# EAGLE design KeyboardMatrixRGB (EAGLE 9.6.2)
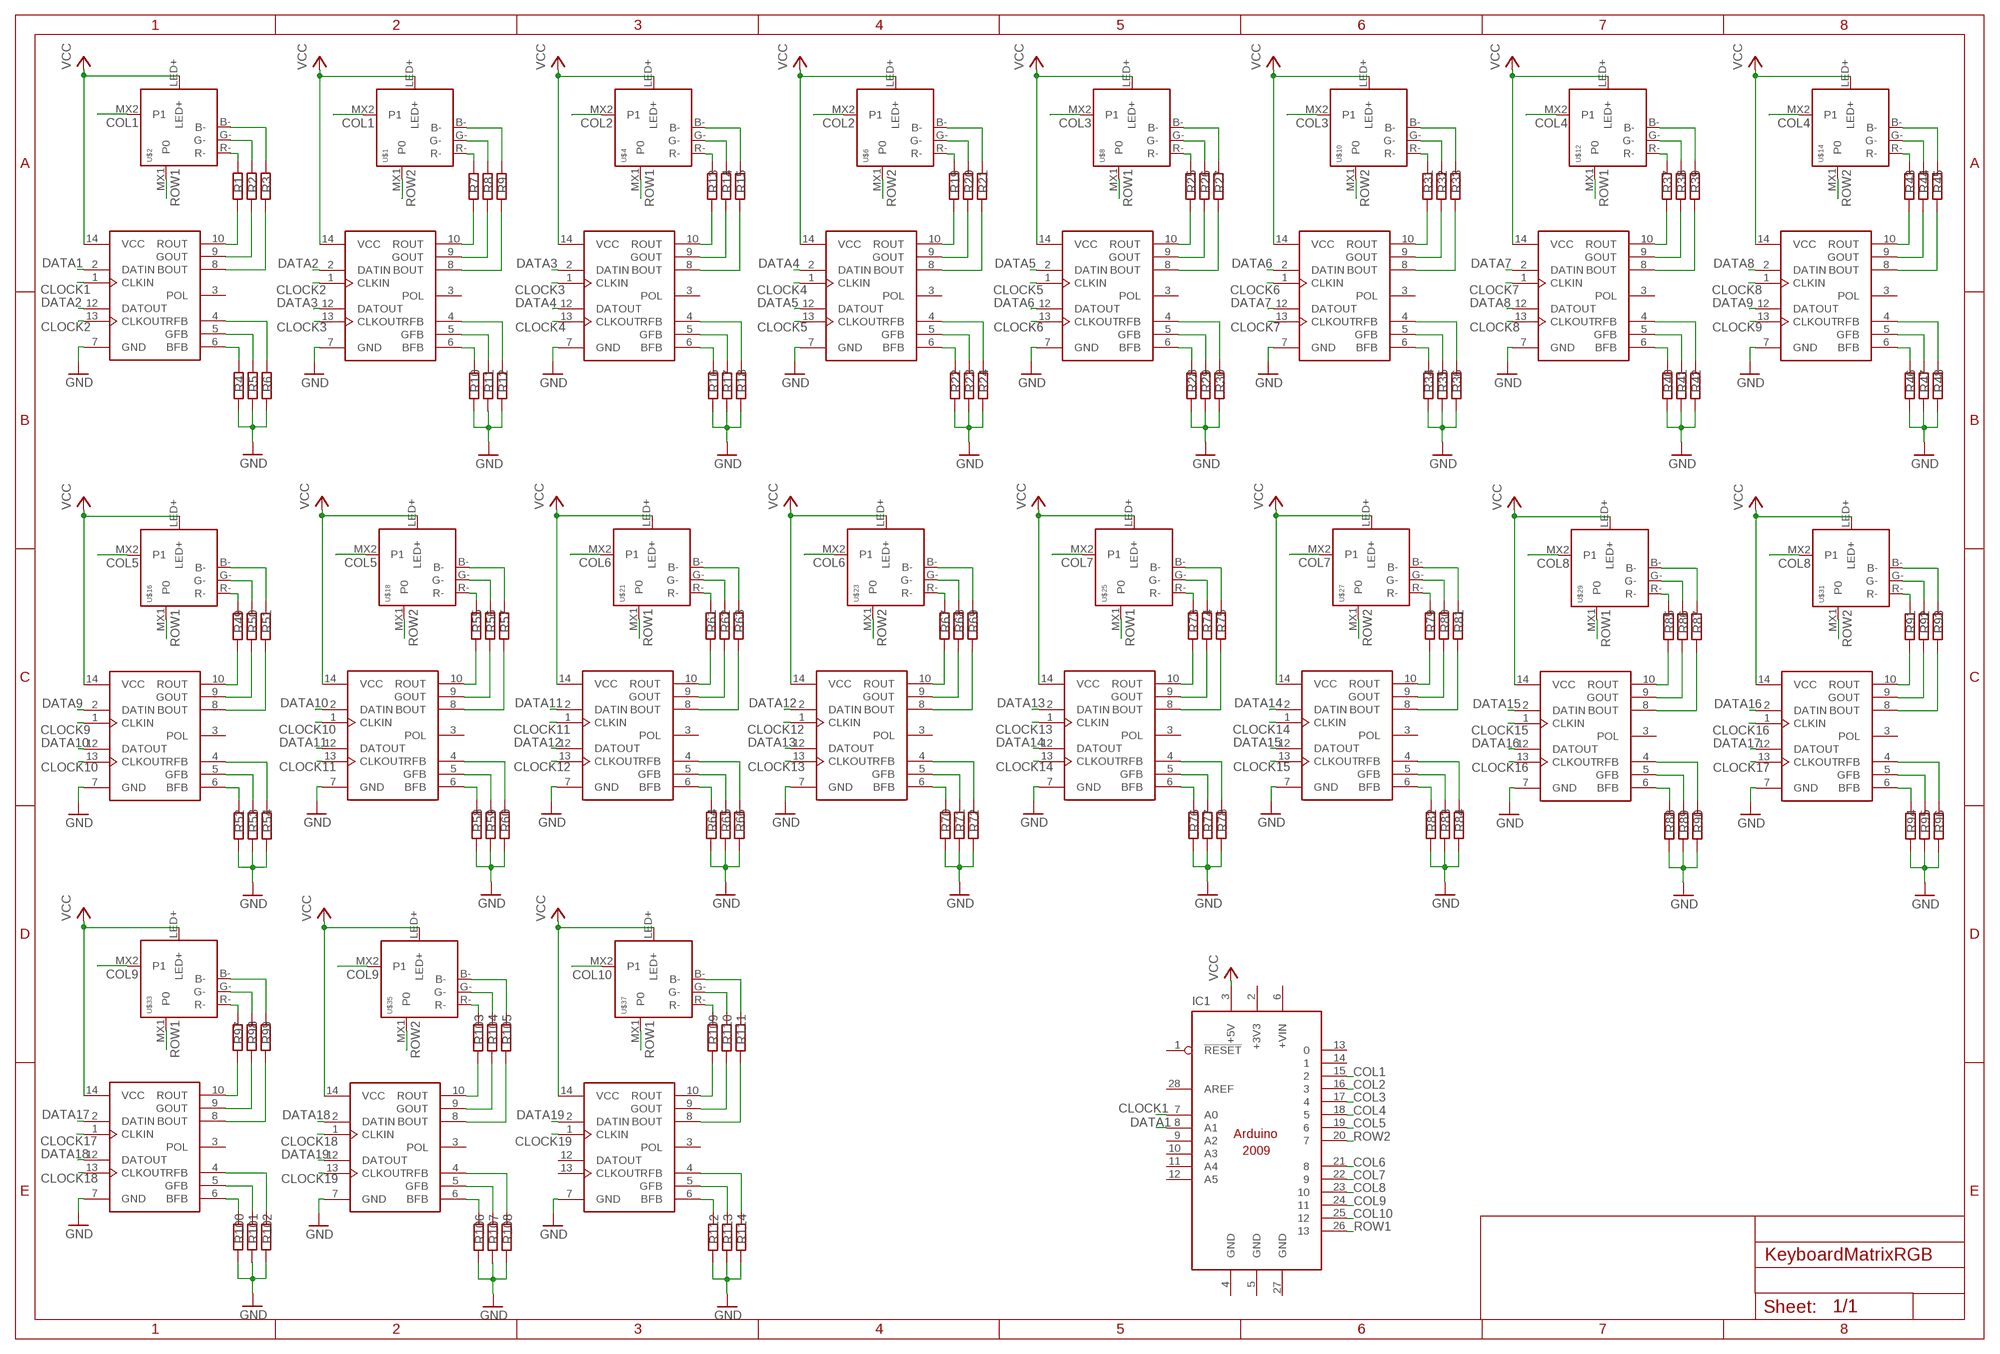
[diagram p0: schematic, sheet 1]

## Parts
IC1  ARDUINO2009_10  [ARDUINO2009]
R1  R-EU_0204/5  [0204/5]
R2  R-EU_0204/5  [0204/5]
R3  R-EU_0204/5  [0204/5]
R4  R-EU_0204/5  [0204/5]
R5  R-EU_0204/5  [0204/5]
R6  R-EU_0204/5  [0204/5]
R7  R-EU_0204/5  [0204/5]
R8  R-EU_0204/5  [0204/5]
R9  R-EU_0204/5  [0204/5]
R10  R-EU_0204/5  [0204/5]
R11  R-EU_0204/5  [0204/5]
R12  R-EU_0204/5  [0204/5]
R13  R-EU_0204/5  [0204/5]
R14  R-EU_0204/5  [0204/5]
R15  R-EU_0204/5  [0204/5]
R16  R-EU_0204/5  [0204/5]
R17  R-EU_0204/5  [0204/5]
R18  R-EU_0204/5  [0204/5]
R19  R-EU_0204/5  [0204/5]
R20  R-EU_0204/5  [0204/5]
R21  R-EU_0204/5  [0204/5]
R22  R-EU_0204/5  [0204/5]
R23  R-EU_0204/5  [0204/5]
R24  R-EU_0204/5  [0204/5]
R25  R-EU_0204/5  [0204/5]
R26  R-EU_0204/5  [0204/5]
R27  R-EU_0204/5  [0204/5]
R28  R-EU_0204/5  [0204/5]
R29  R-EU_0204/5  [0204/5]
R30  R-EU_0204/5  [0204/5]
R31  R-EU_0204/5  [0204/5]
R32  R-EU_0204/5  [0204/5]
R33  R-EU_0204/5  [0204/5]
R34  R-EU_0204/5  [0204/5]
R35  R-EU_0204/5  [0204/5]
R36  R-EU_0204/5  [0204/5]
R37  R-EU_0204/5  [0204/5]
R38  R-EU_0204/5  [0204/5]
R39  R-EU_0204/5  [0204/5]
R40  R-EU_0204/5  [0204/5]
R41  R-EU_0204/5  [0204/5]
R42  R-EU_0204/5  [0204/5]
R43  R-EU_0204/5  [0204/5]
R44  R-EU_0204/5  [0204/5]
R45  R-EU_0204/5  [0204/5]
R46  R-EU_0204/5  [0204/5]
R47  R-EU_0204/5  [0204/5]
R48  R-EU_0204/5  [0204/5]
R49  R-EU_0204/5  [0204/5]
R50  R-EU_0204/5  [0204/5]
R51  R-EU_0204/5  [0204/5]
R52  R-EU_0204/5  [0204/5]
R53  R-EU_0204/5  [0204/5]
R54  R-EU_0204/5  [0204/5]
R55  R-EU_0204/5  [0204/5]
R56  R-EU_0204/5  [0204/5]
R57  R-EU_0204/5  [0204/5]
R58  R-EU_0204/5  [0204/5]
R59  R-EU_0204/5  [0204/5]
R60  R-EU_0204/5  [0204/5]
R61  R-EU_0204/5  [0204/5]
R62  R-EU_0204/5  [0204/5]
R63  R-EU_0204/5  [0204/5]
R64  R-EU_0204/5  [0204/5]
R65  R-EU_0204/5  [0204/5]
R66  R-EU_0204/5  [0204/5]
R67  R-EU_0204/5  [0204/5]
R68  R-EU_0204/5  [0204/5]
R69  R-EU_0204/5  [0204/5]
R70  R-EU_0204/5  [0204/5]
R71  R-EU_0204/5  [0204/5]
R72  R-EU_0204/5  [0204/5]
R73  R-EU_0204/5  [0204/5]
R74  R-EU_0204/5  [0204/5]
R75  R-EU_0204/5  [0204/5]
R76  R-EU_0204/5  [0204/5]
R77  R-EU_0204/5  [0204/5]
R78  R-EU_0204/5  [0204/5]
R79  R-EU_0204/5  [0204/5]
R80  R-EU_0204/5  [0204/5]
R81  R-EU_0204/5  [0204/5]
R82  R-EU_0204/5  [0204/5]
R83  R-EU_0204/5  [0204/5]
R84  R-EU_0204/5  [0204/5]
R85  R-EU_0204/5  [0204/5]
R86  R-EU_0204/5  [0204/5]
R87  R-EU_0204/5  [0204/5]
R88  R-EU_0204/5  [0204/5]
R89  R-EU_0204/5  [0204/5]
R90  R-EU_0204/5  [0204/5]
R91  R-EU_0204/5  [0204/5]
R92  R-EU_0204/5  [0204/5]
R93  R-EU_0204/5  [0204/5]
R94  R-EU_0204/5  [0204/5]
R95  R-EU_0204/5  [0204/5]
R96  R-EU_0204/5  [0204/5]
R97  R-EU_0204/5  [0204/5]
R98  R-EU_0204/5  [0204/5]
R99  R-EU_0204/5  [0204/5]
R100  R-EU_0204/5  [0204/5]
R101  R-EU_0204/5  [0204/5]
R102  R-EU_0204/5  [0204/5]
R103  R-EU_0204/5  [0204/5]
R104  R-EU_0204/5  [0204/5]
R105  R-EU_0204/5  [0204/5]
R106  R-EU_0204/5  [0204/5]
R107  R-EU_0204/5  [0204/5]
R108  R-EU_0204/5  [0204/5]
R109  R-EU_0204/5  [0204/5]
R110  R-EU_0204/5  [0204/5]
R111  R-EU_0204/5  [0204/5]
R112  R-EU_0204/5  [0204/5]
R113  R-EU_0204/5  [0204/5]
R114  R-EU_0204/5  [0204/5]
U$1  KEYSWITCH-RGBLED-MX-1U-RGB  [MX-1U-RGB]
U$2  KEYSWITCH-RGBLED-MX-1U-RGB  [MX-1U-RGB]
U$3  WS2801  [SOP14]
U$4  KEYSWITCH-RGBLED-MX-1U-RGB  [MX-1U-RGB]
U$5  WS2801  [SOP14]
U$6  KEYSWITCH-RGBLED-MX-1U-RGB  [MX-1U-RGB]
U$7  WS2801  [SOP14]
U$8  KEYSWITCH-RGBLED-MX-1U-RGB  [MX-1U-RGB]
U$9  WS2801  [SOP14]
U$10  KEYSWITCH-RGBLED-MX-1U-RGB  [MX-1U-RGB]
U$11  WS2801  [SOP14]
U$12  KEYSWITCH-RGBLED-MX-1U-RGB  [MX-1U-RGB]
U$13  WS2801  [SOP14]
U$14  KEYSWITCH-RGBLED-MX-1U-RGB  [MX-1U-RGB]
U$15  WS2801  [SOP14]
U$16  KEYSWITCH-RGBLED-MX-1U-RGB  [MX-1U-RGB]
U$17  WS2801  [SOP14]
U$18  KEYSWITCH-RGBLED-MX-1U-RGB  [MX-1U-RGB]
U$19  WS2801  [SOP14]
U$20  WS2801  [SOP14]
U$21  KEYSWITCH-RGBLED-MX-1U-RGB  [MX-1U-RGB]
U$22  WS2801  [SOP14]
U$23  KEYSWITCH-RGBLED-MX-1U-RGB  [MX-1U-RGB]
U$24  WS2801  [SOP14]
U$25  KEYSWITCH-RGBLED-MX-1U-RGB  [MX-1U-RGB]
U$26  WS2801  [SOP14]
U$27  KEYSWITCH-RGBLED-MX-1U-RGB  [MX-1U-RGB]
U$28  WS2801  [SOP14]
U$29  KEYSWITCH-RGBLED-MX-1U-RGB  [MX-1U-RGB]
U$30  WS2801  [SOP14]
U$31  KEYSWITCH-RGBLED-MX-1U-RGB  [MX-1U-RGB]
U$32  WS2801  [SOP14]
U$33  KEYSWITCH-RGBLED-MX-1U-RGB  [MX-1U-RGB]
U$34  WS2801  [SOP14]
U$35  KEYSWITCH-RGBLED-MX-1U-RGB  [MX-1U-RGB]
U$36  WS2801  [SOP14]
U$37  KEYSWITCH-RGBLED-MX-1U-RGB  [MX-1U-RGB]
U$38  WS2801  [SOP14]

## Nets
CLOCK1: IC1.7(A0) U$20.1(CLKIN)
CLOCK2: U$3.1(CLKIN) U$20.13(CLKOUT)
CLOCK3: U$3.13(CLKOUT) U$5.1(CLKIN)
CLOCK4: U$5.13(CLKOUT) U$7.1(CLKIN)
CLOCK5: U$7.13(CLKOUT) U$9.1(CLKIN)
CLOCK6: U$9.13(CLKOUT) U$11.1(CLKIN)
CLOCK7: U$11.13(CLKOUT) U$13.1(CLKIN)
CLOCK8: U$13.13(CLKOUT) U$15.1(CLKIN)
CLOCK9: U$15.13(CLKOUT) U$17.1(CLKIN)
CLOCK10: U$17.13(CLKOUT) U$19.1(CLKIN)
CLOCK11: U$19.13(CLKOUT) U$22.1(CLKIN)
CLOCK12: U$22.13(CLKOUT) U$24.1(CLKIN)
CLOCK13: U$24.13(CLKOUT) U$26.1(CLKIN)
CLOCK14: U$26.13(CLKOUT) U$28.1(CLKIN)
CLOCK15: U$28.13(CLKOUT) U$30.1(CLKIN)
CLOCK16: U$30.13(CLKOUT) U$32.1(CLKIN)
CLOCK17: U$32.13(CLKOUT) U$34.1(CLKIN)
CLOCK18: U$34.13(CLKOUT) U$36.1(CLKIN)
CLOCK19: U$36.13(CLKOUT) U$38.1(CLKIN)
COL1: IC1.15 U$1.MX2(P1) U$2.MX2(P1)
COL2: IC1.16 U$4.MX2(P1) U$6.MX2(P1)
COL3: IC1.17 U$8.MX2(P1) U$10.MX2(P1)
COL4: IC1.18 U$12.MX2(P1) U$14.MX2(P1)
COL5: IC1.19 U$16.MX2(P1) U$18.MX2(P1)
COL6: IC1.21 U$21.MX2(P1) U$23.MX2(P1)
COL7: IC1.22 U$25.MX2(P1) U$27.MX2(P1)
COL8: IC1.23 U$29.MX2(P1) U$31.MX2(P1)
COL9: IC1.24 U$33.MX2(P1) U$35.MX2(P1)
COL10: IC1.25 U$37.MX2(P1)
DATA1: IC1.8(A1) U$20.2(DATIN)
DATA2: U$3.2(DATIN) U$20.12(DATOUT)
DATA3: U$3.12(DATOUT) U$5.2(DATIN)
DATA4: U$5.12(DATOUT) U$7.2(DATIN)
DATA5: U$7.12(DATOUT) U$9.2(DATIN)
DATA6: U$9.12(DATOUT) U$11.2(DATIN)
DATA7: U$11.12(DATOUT) U$13.2(DATIN)
DATA8: U$13.12(DATOUT) U$15.2(DATIN)
DATA9: U$15.12(DATOUT) U$17.2(DATIN)
DATA10: U$17.12(DATOUT) U$19.2(DATIN)
DATA11: U$19.12(DATOUT) U$22.2(DATIN)
DATA12: U$22.12(DATOUT) U$24.2(DATIN)
DATA13: U$24.12(DATOUT) U$26.2(DATIN)
DATA14: U$26.12(DATOUT) U$28.2(DATIN)
DATA15: U$28.12(DATOUT) U$30.2(DATIN)
DATA16: U$30.12(DATOUT) U$32.2(DATIN)
DATA17: U$32.12(DATOUT) U$34.2(DATIN)
DATA18: U$34.12(DATOUT) U$36.2(DATIN)
DATA19: U$36.12(DATOUT) U$38.2(DATIN)
GND: R4.1 R5.1 R6.1 R10.1 R11.1 R12.1 R16.1 R17.1 R18.1 R22.1 R23.1 R24.1 R28.1 R29.1 R30.1 R34.1 R35.1 R36.1 R40.1 R41.1 R42.1 R46.1 R47.1 R48.1 R52.1 R53.1 R54.1 R58.1 R59.1 R60.1 R64.1 R65.1 R66.1 R70.1 R71.1 R72.1 R76.1 R77.1 R78.1 R82.1 R83.1 R84.1 R88.1 R89.1 R90.1 R94.1 R95.1 R96.1 R100.1 R101.1 R102.1 R106.1 R107.1 R108.1 R112.1 R113.1 R114.1 U$3.7(GND) U$5.7(GND) U$7.7(GND) U$9.7(GND) U$11.7(GND) U$13.7(GND) U$15.7(GND) U$17.7(GND) U$19.7(GND) U$20.7(GND) U$22.7(GND) U$24.7(GND) U$26.7(GND) U$28.7(GND) U$30.7(GND) U$32.7(GND) U$34.7(GND) U$36.7(GND) U$38.7(GND)
N$1: R1.2 U$2.R-
N$2: R2.2 U$2.G-
N$3: R3.2 U$2.B-
N$4: R1.1 U$20.10(ROUT)
N$5: R2.1 U$20.9(GOUT)
N$6: R3.1 U$20.8(BOUT)
N$7: R4.2 U$20.6(BFB)
N$8: R5.2 U$20.5(GFB)
N$9: R6.2 U$20.4(RFB)
N$10: R49.2 U$16.R-
N$11: R7.2 U$1.R-
N$12: R8.2 U$1.G-
N$13: R9.2 U$1.B-
N$14: R7.1 U$3.10(ROUT)
N$15: R8.1 U$3.9(GOUT)
N$16: R9.1 U$3.8(BOUT)
N$17: R10.2 U$3.6(BFB)
N$18: R11.2 U$3.5(GFB)
N$19: R12.2 U$3.4(RFB)
N$20: R13.2 U$4.R-
N$21: R14.2 U$4.G-
N$22: R15.2 U$4.B-
N$23: R13.1 U$5.10(ROUT)
N$24: R14.1 U$5.9(GOUT)
N$25: R15.1 U$5.8(BOUT)
N$26: R16.2 U$5.6(BFB)
N$27: R17.2 U$5.5(GFB)
N$28: R18.2 U$5.4(RFB)
N$29: R19.2 U$6.R-
N$30: R20.2 U$6.G-
N$31: R21.2 U$6.B-
N$32: R19.1 U$7.10(ROUT)
N$33: R20.1 U$7.9(GOUT)
N$34: R21.1 U$7.8(BOUT)
N$35: R22.2 U$7.6(BFB)
N$36: R23.2 U$7.5(GFB)
N$37: R24.2 U$7.4(RFB)
N$38: R25.2 U$8.R-
N$39: R26.2 U$8.G-
N$40: R27.2 U$8.B-
N$41: R25.1 U$9.10(ROUT)
N$42: R26.1 U$9.9(GOUT)
N$43: R27.1 U$9.8(BOUT)
N$44: R28.2 U$9.6(BFB)
N$45: R29.2 U$9.5(GFB)
N$46: R30.2 U$9.4(RFB)
N$47: R31.2 U$10.R-
N$48: R32.2 U$10.G-
N$49: R33.2 U$10.B-
N$50: R31.1 U$11.10(ROUT)
N$51: R32.1 U$11.9(GOUT)
N$52: R33.1 U$11.8(BOUT)
N$53: R34.2 U$11.6(BFB)
N$54: R35.2 U$11.5(GFB)
N$55: R36.2 U$11.4(RFB)
N$56: R37.2 U$12.R-
N$57: R38.2 U$12.G-
N$58: R39.2 U$12.B-
N$59: R37.1 U$13.10(ROUT)
N$60: R38.1 U$13.9(GOUT)
N$61: R39.1 U$13.8(BOUT)
N$62: R40.2 U$13.6(BFB)
N$63: R41.2 U$13.5(GFB)
N$64: R42.2 U$13.4(RFB)
N$65: R43.2 U$14.R-
N$66: R44.2 U$14.G-
N$67: R45.2 U$14.B-
N$68: R43.1 U$15.10(ROUT)
N$69: R44.1 U$15.9(GOUT)
N$70: R45.1 U$15.8(BOUT)
N$71: R46.2 U$15.6(BFB)
N$72: R47.2 U$15.5(GFB)
N$73: R48.2 U$15.4(RFB)
N$74: R50.2 U$16.G-
N$75: R51.2 U$16.B-
N$76: R49.1 U$17.10(ROUT)
N$77: R50.1 U$17.9(GOUT)
N$78: R51.1 U$17.8(BOUT)
N$79: R52.2 U$17.6(BFB)
N$80: R53.2 U$17.5(GFB)
N$81: R54.2 U$17.4(RFB)
N$82: R97.2 U$33.R-
N$83: R55.2 U$18.R-
N$84: R56.2 U$18.G-
N$85: R57.2 U$18.B-
N$86: R55.1 U$19.10(ROUT)
N$87: R56.1 U$19.9(GOUT)
N$88: R57.1 U$19.8(BOUT)
N$89: R58.2 U$19.6(BFB)
N$90: R59.2 U$19.5(GFB)
N$91: R60.2 U$19.4(RFB)
N$92: R61.2 U$21.R-
N$93: R62.2 U$21.G-
N$94: R63.2 U$21.B-
N$95: R61.1 U$22.10(ROUT)
N$96: R62.1 U$22.9(GOUT)
N$97: R63.1 U$22.8(BOUT)
N$98: R64.2 U$22.6(BFB)
N$99: R65.2 U$22.5(GFB)
N$100: R66.2 U$22.4(RFB)
N$101: R67.2 U$23.R-
N$102: R68.2 U$23.G-
N$103: R69.2 U$23.B-
N$104: R67.1 U$24.10(ROUT)
N$105: R68.1 U$24.9(GOUT)
N$106: R69.1 U$24.8(BOUT)
N$107: R70.2 U$24.6(BFB)
N$108: R71.2 U$24.5(GFB)
N$109: R72.2 U$24.4(RFB)
N$110: R73.2 U$25.R-
N$111: R74.2 U$25.G-
N$112: R75.2 U$25.B-
N$113: R73.1 U$26.10(ROUT)
N$114: R74.1 U$26.9(GOUT)
N$115: R75.1 U$26.8(BOUT)
N$116: R76.2 U$26.6(BFB)
N$117: R77.2 U$26.5(GFB)
N$118: R78.2 U$26.4(RFB)
N$119: R79.2 U$27.R-
N$120: R80.2 U$27.G-
N$121: R81.2 U$27.B-
N$122: R79.1 U$28.10(ROUT)
N$123: R80.1 U$28.9(GOUT)
N$124: R81.1 U$28.8(BOUT)
N$125: R82.2 U$28.6(BFB)
N$126: R83.2 U$28.5(GFB)
N$127: R84.2 U$28.4(RFB)
N$128: R85.2 U$29.R-
N$129: R86.2 U$29.G-
N$130: R87.2 U$29.B-
N$131: R85.1 U$30.10(ROUT)
N$132: R86.1 U$30.9(GOUT)
N$133: R87.1 U$30.8(BOUT)
N$134: R88.2 U$30.6(BFB)
N$135: R89.2 U$30.5(GFB)
N$136: R90.2 U$30.4(RFB)
N$137: R91.2 U$31.R-
N$138: R92.2 U$31.G-
N$139: R93.2 U$31.B-
N$140: R91.1 U$32.10(ROUT)
N$141: R92.1 U$32.9(GOUT)
N$142: R93.1 U$32.8(BOUT)
N$143: R94.2 U$32.6(BFB)
N$144: R95.2 U$32.5(GFB)
N$145: R96.2 U$32.4(RFB)
N$146: R98.2 U$33.G-
N$147: R99.2 U$33.B-
N$148: R97.1 U$34.10(ROUT)
N$149: R98.1 U$34.9(GOUT)
N$150: R99.1 U$34.8(BOUT)
N$151: R100.2 U$34.6(BFB)
N$152: R101.2 U$34.5(GFB)
N$153: R102.2 U$34.4(RFB)
N$154: R103.2 U$35.R-
N$155: R104.2 U$35.G-
N$156: R105.2 U$35.B-
N$157: R103.1 U$36.10(ROUT)
N$158: R104.1 U$36.9(GOUT)
N$159: R105.1 U$36.8(BOUT)
N$160: R106.2 U$36.6(BFB)
N$161: R107.2 U$36.5(GFB)
N$162: R108.2 U$36.4(RFB)
N$163: R109.2 U$37.R-
N$164: R110.2 U$37.G-
N$165: R111.2 U$37.B-
N$166: R109.1 U$38.10(ROUT)
N$167: R110.1 U$38.9(GOUT)
N$168: R111.1 U$38.8(BOUT)
N$169: R112.2 U$38.6(BFB)
N$170: R113.2 U$38.5(GFB)
N$171: R114.2 U$38.4(RFB)
ROW1: IC1.26 U$2.MX1(P0) U$4.MX1(P0) U$8.MX1(P0) U$12.MX1(P0) U$16.MX1(P0) U$21.MX1(P0) U$25.MX1(P0) U$29.MX1(P0) U$33.MX1(P0) U$37.MX1(P0)
ROW2: IC1.20 U$1.MX1(P0) U$6.MX1(P0) U$10.MX1(P0) U$14.MX1(P0) U$18.MX1(P0) U$23.MX1(P0) U$27.MX1(P0) U$31.MX1(P0) U$35.MX1(P0)
VCC: IC1.3(+5V) U$1.LED+ U$2.LED+ U$3.14(VCC) U$4.LED+ U$5.14(VCC) U$6.LED+ U$7.14(VCC) U$8.LED+ U$9.14(VCC) U$10.LED+ U$11.14(VCC) U$12.LED+ U$13.14(VCC) U$14.LED+ U$15.14(VCC) U$16.LED+ U$17.14(VCC) U$18.LED+ U$19.14(VCC) U$20.14(VCC) U$21.LED+ U$22.14(VCC) U$23.LED+ U$24.14(VCC) U$25.LED+ U$26.14(VCC) U$27.LED+ U$28.14(VCC) U$29.LED+ U$30.14(VCC) U$31.LED+ U$32.14(VCC) U$33.LED+ U$34.14(VCC) U$35.LED+ U$36.14(VCC) U$37.LED+ U$38.14(VCC)
Unconnected: IC1.1(!RESET) IC1.6(+VIN) IC1.9(A2) IC1.10(A3) IC1.11(A4) IC1.12(A5) IC1.13 IC1.14 IC1.28(AREF) U$3.3(POL) U$5.3(POL) U$7.3(POL) U$9.3(POL) U$11.3(POL) U$13.3(POL) U$15.3(POL) U$17.3(POL) U$19.3(POL) U$20.3(POL) U$22.3(POL) U$24.3(POL) U$26.3(POL) U$28.3(POL) U$30.3(POL) U$32.3(POL) U$34.3(POL) U$36.3(POL) U$38.3(POL) U$38.12(DATOUT) U$38.13(CLKOUT)

## Power pins joined to a net without a drawn wire
+3V3: IC1.2(+3V3)
GND: IC1.4(GND) IC1.5(GND) IC1.27(GND)

## Library data of the parts
IC1 = arduino:ARDUINO2009_1: The Arduino Duemilanove ("2009") is a microcontroller board based on the ATmega168 or ATmega328. - 14 digital input/output pins (of which 6 can be used as PWM outputs) - 6 analog inputs, a 16 MHz crystal oscillator - USB connection - power jack - ISP header - reset button It contains everything needed to support the microcontroller; simply connect it to a computer with a USB cable or power it with a AC-to-DC adapter or battery to get started http://arduino.cc/en/Main/ArduinoBoardDuemilanove
R1-R114 = rcl:R-EU_: RESISTOR, European symbol; SPICEPREFIX: R
U$1 U$2 U$4 U$6 U$8 U$10 U$12 U$14 U$16 U$18 U$21 U$23 U$25 U$27 U$29 U$31 U$33 U$35 U$37 = Keyboard:KEYSWITCH-RGBLED
U$3 U$5 U$7 U$9 U$11 U$13 U$15 U$17 U$19 U$20 U$22 U$24 U$26 U$28 U$30 U$32 U$34 U$36 U$38 = BillPorter:WS2801: WS2801 3-Channel Constant Current LED Driver with PWM Outputs. Same one sold at Sparkfun and adafruit. Specs @ http://www.adafruit.com/datasheets/WS2801.pdf

## Board
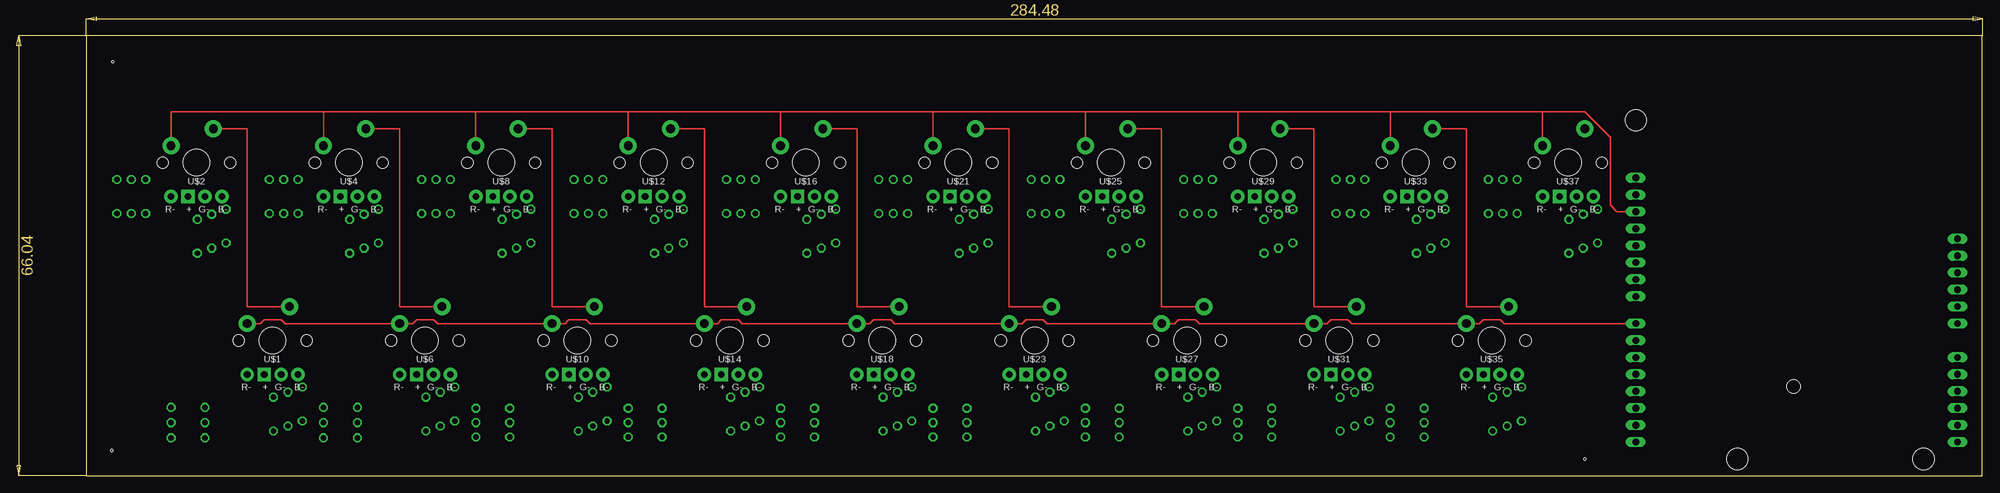
[diagram p1: board, top side]
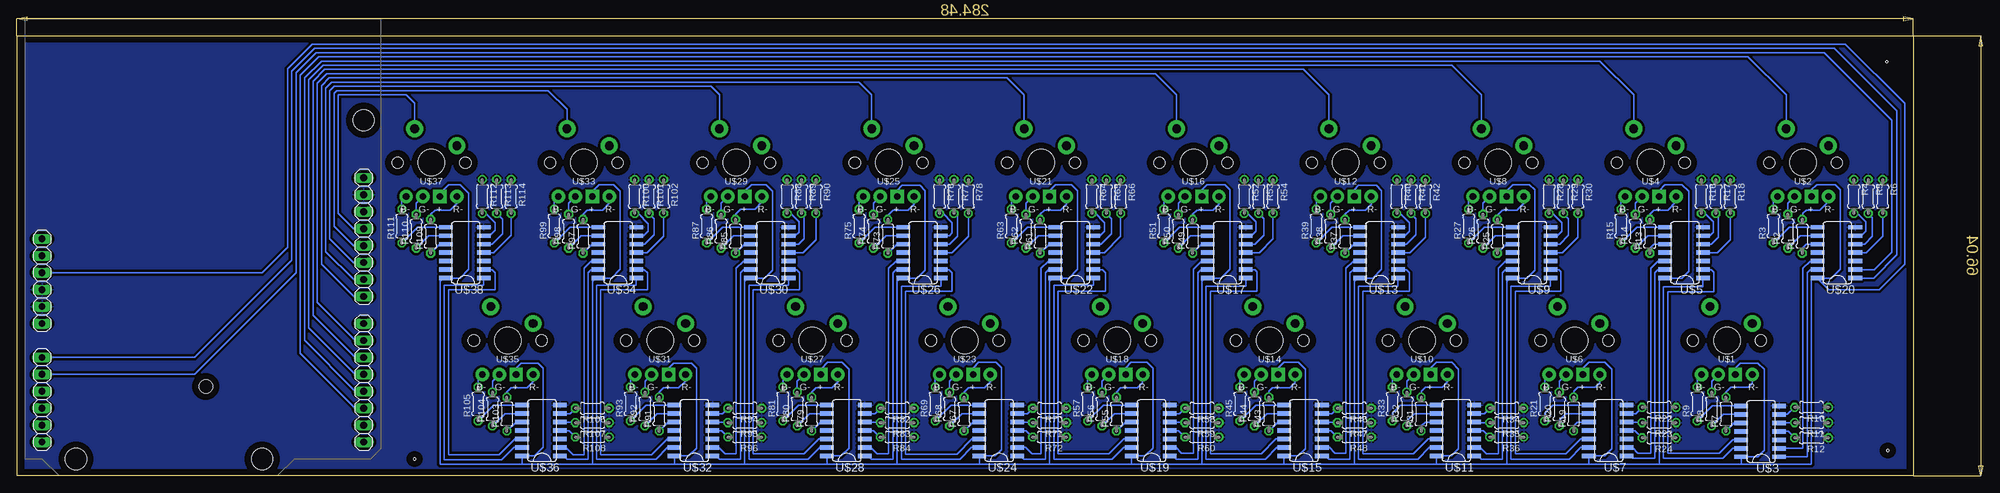
[diagram p2: board, bottom side, seen from below]

Size 284.4 x 66.03 mm. Coordinates in mm from the lower left corner, seen from the top.
Outline: 0,0 284.4,0 284.4,66.03 0,66.03 0,0
Copper layers (1*16): Top 0.035mm / dielectric 1.5mm / Bottom 0.035mm
Design rules "default *": minimum track width 6mil, minimum drill 0.35mm, track to track 15mil, track to pad 15mil, pad to pad 15mil, via to via 15mil, smd to smd 3mil, copper to edge 40mil, drill to drill 12mil, minimum pad ring 10mil, minimum via ring 8mil, stop-mask expansion 4mil, vias tented up to drill 0mil, thermal gap 10mil
Holes 0.35 mm at 224.79,2.54 3.81,3.81 3.94,62.1

### Footprints (pad centres in the part's own frame; a part is rotated, then mirrored left to right if it is on the bottom)
ARDUINO2009 = drill 1.016 long: 1 33.02,2.54; 2 35.56,2.54; 3 38.1,2.54; 4 40.64,2.54; 5 43.18,2.54; 6 45.72,2.54; 7 50.8,2.54; 8 53.34,2.54; 9 55.88,2.54; 10 58.42,2.54; 11 60.96,2.54; 12 63.5,2.54; 13 63.5,50.8; 14 60.96,50.8; 15 58.42,50.8; 16 55.88,50.8; 17 53.34,50.8; 18 50.8,50.8; 19 48.26,50.8; 20 45.72,50.8; 21 41.656,50.8; 22 39.116,50.8; 23 36.576,50.8; 24 34.036,50.8; 25 31.496,50.8; 26 28.956,50.8; 27 26.416,50.8; 28 23.876,50.8 | hole 3.2: 15.24,50.8; 66.04,35.56; 66.04,7.62 | hole 2: 55.17,27.114
0204/5 = drill 0.813 octagon: 1 -2.54,0; 2 2.54,0
MX-1U-RGB = drill 1 pad 2: B- 3.81,-5.08; G- 1.27,-5.08; R- -3.81,-5.08 | drill 1 pad 2 square: LED+ -1.27,-5.08 | drill 1.3 pad 2.54: MX1 -3.81,2.54; MX2 2.54,5.08 | hole 4: 0,0 | hole 1.7: -5.08,0; 5.08,0
SOP14 = smd 0.66 x 2.032: 1 -3.345,-2.76; 2 -2.075,-2.76; 3 -0.805,-2.76; 4 0.465,-2.76; 5 1.735,-2.76; 6 3.005,-2.76; 7 4.275,-2.76; 8 4.275,2.917; 9 3.005,2.917; 10 1.735,2.917; 11 0.465,2.917; 12 -0.805,2.917; 13 -2.075,2.917; 14 -3.345,2.917

### Placement (x,y rotation side)
IC1  283.21,68.58 270 bottom
R1  16.64,35.94 90 bottom
R2  18.8,36.7 90 bottom
R3  20.95,37.47 90 bottom
R4  8.89,41.91 270 bottom
R5  6.73,41.91 270 bottom
R6  4.57,41.91 270 bottom
R7  28.07,9.27 90 bottom
R8  30.23,10.03 90 bottom
R9  32.38,10.79 90 bottom
R10  15.24,10.29 180 bottom
R11  15.24,8 180 bottom
R12  15.24,5.71 180 bottom
R13  39.5,35.94 90 bottom
R14  41.66,36.7 90 bottom
R15  43.81,37.47 90 bottom
R16  31.75,41.91 270 bottom
R17  29.59,41.91 270 bottom
R18  27.43,41.91 270 bottom
R19  50.93,9.27 90 bottom
R20  53.09,10.03 90 bottom
R21  55.24,10.79 90 bottom
R22  38.1,10.29 180 bottom
R23  38.1,8 180 bottom
R24  38.1,5.71 180 bottom
R25  62.36,35.94 90 bottom
R26  64.52,36.7 90 bottom
R27  66.67,37.47 90 bottom
R28  54.61,41.91 270 bottom
R29  52.45,41.91 270 bottom
R30  50.29,41.91 270 bottom
R31  73.79,9.27 90 bottom
R32  75.95,10.03 90 bottom
R33  78.11,10.79 90 bottom
R34  60.96,10.16 180 bottom
R35  60.96,8 180 bottom
R36  60.96,5.84 180 bottom
R37  85.22,35.94 90 bottom
R38  87.38,36.7 90 bottom
R39  89.53,37.47 90 bottom
R40  77.47,41.91 270 bottom
R41  75.31,41.91 270 bottom
R42  73.15,41.91 270 bottom
R43  96.65,9.27 90 bottom
R44  98.81,10.03 90 bottom
R45  100.97,10.79 90 bottom
R46  83.82,10.16 180 bottom
R47  83.82,8 180 bottom
R48  83.82,5.84 180 bottom
R49  108.08,35.94 90 bottom
R50  110.24,36.7 90 bottom
R51  112.39,37.47 90 bottom
R52  100.33,41.91 270 bottom
R53  98.17,41.91 270 bottom
R54  96.01,41.91 270 bottom
R55  119.51,9.27 90 bottom
R56  121.67,10.03 90 bottom
R57  123.83,10.79 90 bottom
R58  106.68,10.16 180 bottom
R59  106.68,8 180 bottom
R60  106.68,5.84 180 bottom
R61  130.94,35.94 90 bottom
R62  133.1,36.7 90 bottom
R63  135.25,37.47 90 bottom
R64  123.19,41.91 270 bottom
R65  121.03,41.91 270 bottom
R66  118.87,41.91 270 bottom
R67  142.37,9.27 90 bottom
R68  144.53,10.03 90 bottom
R69  146.69,10.79 90 bottom
R70  129.54,10.16 180 bottom
R71  129.54,8 180 bottom
R72  129.54,5.84 180 bottom
R73  153.8,35.94 90 bottom
R74  155.96,36.7 90 bottom
R75  158.12,37.47 90 bottom
R76  146.05,41.91 270 bottom
R77  143.89,41.91 270 bottom
R78  141.73,41.91 270 bottom
R79  165.23,9.27 90 bottom
R80  167.39,10.03 90 bottom
R81  169.54,10.79 90 bottom
R82  152.4,10.16 180 bottom
R83  152.4,8 180 bottom
R84  152.4,5.84 180 bottom
R85  176.66,35.94 90 bottom
R86  178.82,36.7 90 bottom
R87  180.97,37.47 90 bottom
R88  168.91,41.91 270 bottom
R89  166.75,41.91 270 bottom
R90  164.59,41.91 270 bottom
R91  188.09,9.27 90 bottom
R92  190.25,10.03 90 bottom
R93  192.41,10.79 90 bottom
R94  175.26,10.16 180 bottom
R95  175.26,8 180 bottom
R96  175.26,5.84 180 bottom
R97  199.52,35.94 90 bottom
R98  201.68,36.7 90 bottom
R99  203.84,37.47 90 bottom
R100  191.77,41.91 270 bottom
R101  189.61,41.91 270 bottom
R102  187.45,41.91 270 bottom
R103  210.95,9.27 90 bottom
R104  213.11,10.03 90 bottom
R105  215.26,10.79 90 bottom
R106  198.12,10.16 180 bottom
R107  198.12,8 180 bottom
R108  198.12,5.84 180 bottom
R109  222.38,35.94 90 bottom
R110  224.54,36.7 90 bottom
R111  226.69,37.47 90 bottom
R112  214.63,41.91 270 bottom
R113  212.47,41.91 270 bottom
R114  210.31,41.91 270 bottom
U$1  27.94,20.32 0 top
U$2  16.51,46.99 0 top
U$3  22.86,6.22 90 bottom
U$4  39.37,46.99 0 top
U$5  34.29,33.02 90 bottom
U$6  50.8,20.32 0 top
U$7  45.72,6.35 90 bottom
U$8  62.23,46.99 0 top
U$9  57.15,33.02 90 bottom
U$10  73.66,20.32 0 top
U$11  68.58,6.35 90 bottom
U$12  85.09,46.99 0 top
U$13  80.01,33.02 90 bottom
U$14  96.52,20.32 0 top
U$15  91.44,6.35 90 bottom
U$16  107.95,46.99 0 top
U$17  102.87,33.02 90 bottom
U$18  119.38,20.32 0 top
U$19  114.3,6.35 90 bottom
U$20  11.43,33.02 90 bottom
U$21  130.81,46.99 0 top
U$22  125.73,33.02 90 bottom
U$23  142.24,20.32 0 top
U$24  137.16,6.35 90 bottom
U$25  153.67,46.99 0 top
U$26  148.59,33.02 90 bottom
U$27  165.1,20.32 0 top
U$28  160.02,6.35 90 bottom
U$29  176.53,46.99 0 top
U$30  171.45,33.02 90 bottom
U$31  187.96,20.32 0 top
U$32  182.88,6.35 90 bottom
U$33  199.39,46.99 0 top
U$34  194.31,33.02 90 bottom
U$35  210.82,20.32 0 top
U$36  205.74,6.35 90 bottom
U$37  222.25,46.99 0 top
U$38  217.17,33.02 90 bottom

### Tracks (layer width: path | path; a pad name or v marks a point on that pad's centre or on a via)
CLOCK1
  Bottom 0.203: U$20.1 5.88,29.68 2.41,33.15 2.41,54.74 11.81,64.14 239.78,64.14 243.21,60.71 243.21,32.38 257.81,17.78 IC1.7
CLOCK2
  Bottom 0.203: U$20.13 15.41,30.95 15.88,30.48 15.88,2.88 U$3.1
CLOCK3
  Bottom 0.203: U$3.13 27.05,4.15 28.57,2.62 37.47,2.62 37.47,28.41 31.53,28.41 U$5.1
CLOCK4
  Bottom 0.203: U$7.1 42.38,3 42.04,2.67 38.73,2.67 38.73,30.48 38.27,30.95 U$5.13
CLOCK5
  Bottom 0.203: U$7.13 49.83,4.28 51.56,2.54 60.33,2.54 60.33,28.45 54.39,28.45 U$9.1
CLOCK6
  Bottom 0.203: U$9.13 61.13,30.95 61.59,30.48 61.59,2.54 64.77,2.54 65.23,3 U$11.1
CLOCK7
  Bottom 0.203: U$11.13 72.56,4.28 74.3,2.54 83.19,2.54 83.19,28.45 77.25,28.45 U$13.1
CLOCK8
  Bottom 0.203: U$13.13 83.99,30.95 84.45,30.48 84.45,2.54 87.63,2.54 88.01,2.92 88.01,3.05 88.64,3.05 U$15.1
CLOCK9
  Bottom 0.203: U$15.13 95.42,4.28 97.16,2.54 106.05,2.54 106.05,28.47 100.11,28.47 U$17.1
CLOCK10
  Bottom 0.203: U$17.13 106.85,30.95 107.31,30.48 107.31,2.54 110.49,2.54 110.87,2.92 110.87,3.05 111.5,3.05 U$19.1
CLOCK11
  Bottom 0.203: U$19.13 118.41,4.28 120.14,2.54 128.91,2.54 128.91,28.57 122.97,28.57 U$22.1
CLOCK12
  Bottom 0.203: U$22.13 129.71,30.95 130.18,30.48 130.18,2.54 133.35,2.54 133.73,2.92 133.73,3.05 134.36,3.05 U$24.1
CLOCK13
  Bottom 0.203: U$24.13 141.27,4.28 143,2.54 151.76,2.54 151.76,28.45 145.83,28.45 U$26.1
CLOCK14
  Bottom 0.203: U$26.13 152.57,30.95 153.03,30.48 153.03,2.54 156.21,2.54 156.59,2.92 156.59,3.05 157.22,3.05 U$28.1
CLOCK15
  Bottom 0.203: U$28.13 164,4.28 165.74,2.54 174.62,2.54 174.62,28.57 168.69,28.57 U$30.1
CLOCK16
  Bottom 0.203: U$30.13 175.43,30.95 175.9,30.48 175.9,2.54 179.07,2.54 179.53,3 U$32.1
CLOCK17
  Bottom 0.203: U$32.13 186.86,4.28 188.59,2.54 197.49,2.54 197.49,28.57 191.55,28.57 U$34.1
CLOCK18
  Bottom 0.203: U$34.13 198.29,30.95 198.75,30.48 198.75,2.54 201.93,2.54 202.31,2.92 202.31,3.05 202.94,3.05 U$36.1
CLOCK19
  Bottom 0.203: U$36.13 209.85,4.28 211.71,2.41 220.34,2.41 220.34,28.57 214.41,28.57 U$38.1
COL1
  Top 0.203: U$2.MX2 24.13,52.07 24.13,25.4 U$1.MX2
  Bottom 0.203: U$2.MX2 19.05,57.15 24.77,62.87 239.14,62.87 241.94,60.07 241.94,18.41 233.68,10.16 IC1.15
COL2
  Top 0.203: U$4.MX2 46.99,52.07 46.99,25.4 U$6.MX2
  Bottom 0.203: U$4.MX2 41.91,57.15 46.99,62.23 238.76,62.23 241.3,59.69 241.3,20.32 233.68,12.7 IC1.16
COL3
  Top 0.203: U$8.MX2 69.85,52.07 69.85,25.4 U$10.MX2
  Bottom 0.203: U$8.MX2 64.77,57.15 69.22,61.59 238.51,61.59 240.66,59.44 240.66,22.23 233.68,15.24 IC1.17
COL4
  Top 0.203: U$12.MX2 92.71,52.07 92.71,25.4 U$14.MX2
  Bottom 0.203: U$12.MX2 87.63,57.15 91.44,60.96 238.25,60.96 240.03,59.18 240.03,24.13 233.68,17.78 IC1.18
COL5
  Top 0.203: U$18.MX2 115.57,25.4 115.57,52.07 U$16.MX2
  Bottom 0.203: U$16.MX2 110.49,57.15 113.67,60.33 238,60.33 239.4,58.93 239.4,26.04 233.68,20.32 IC1.19
COL6
  Top 0.203: U$21.MX2 138.43,52.07 138.43,25.4 U$23.MX2
  Bottom 0.203: U$21.MX2 133.35,57.15 135.89,59.69 237.62,59.69 238.76,58.55 238.76,31.75 233.93,26.92 IC1.21
COL7
  Top 0.203: U$27.MX2 161.29,25.4 161.29,52.07 U$25.MX2
  Bottom 0.203: U$25.MX2 156.21,57.15 158.12,59.05 237.24,59.05 238.12,58.17 238.12,33.66 233.93,29.46 IC1.22
COL8
  Top 0.203: U$29.MX2 184.15,52.07 184.15,25.4 U$31.MX2
  Bottom 0.203: U$29.MX2 179.07,57.15 180.34,58.42 236.85,58.42 237.49,57.78 237.49,35.56 233.93,32 IC1.23
COL9
  Top 0.203: U$33.MX2 207.01,52.07 207.01,25.4 U$35.MX2
  Bottom 0.203: U$33.MX2 201.93,54.99 204.72,57.78 236.47,57.78 236.85,57.4 236.85,37.47 233.93,34.54 IC1.24
COL10
  Bottom 0.203: U$37.MX2 224.79,55.88 226.06,57.15 236.22,57.15 236.22,39.37 233.93,37.08 IC1.25
DATA1
  Bottom 0.203: U$20.2 5.8,30.95 3.17,33.57 3.17,53.34 13.34,63.5 239.52,63.5 242.57,60.45 242.57,30.48 257.81,15.24 IC1.8
DATA2
  Bottom 0.203: U$3.2 16.51,4.15 16.51,31.11 15.41,32.22 U$20.12
DATA3
  Bottom 0.203: U$5.2 30.26,30.95 29.88,30.56 29.88,27.64 36.83,27.64 36.83,3.39 29.08,3.39 27.05,5.42 U$3.12
DATA4
  Bottom 0.203: U$7.2 42.12,4.28 41.27,3.43 39.37,3.43 39.37,31.11 38.27,32.22 U$5.12
DATA5
  Bottom 0.203: U$7.12 49.83,5.54 52.07,3.3 59.69,3.3 59.69,27.69 52.83,27.69 52.83,30.61 53.17,30.95 U$9.2
DATA6
  Bottom 0.203: U$9.12 61.13,32.22 62.23,31.11 62.23,3.3 64.01,3.3 64.98,4.28 U$11.2
DATA7
  Bottom 0.203: U$11.12 72.69,5.54 74.93,3.3 82.55,3.3 82.55,27.69 75.56,27.69 75.56,30.48 76.03,30.95 U$13.2
DATA8
  Bottom 0.203: U$15.2 87.59,4.28 86.74,3.43 85.09,3.43 85.09,31.11 83.99,32.22 U$13.12
DATA9
  Bottom 0.203: U$15.12 95.55,5.54 97.79,3.3 105.41,3.3 105.41,27.69 98.42,27.69 98.42,30.61 98.76,30.95 U$17.2
DATA10
  Bottom 0.203: U$19.2 110.57,4.28 109.73,3.43 107.95,3.43 107.95,30.99 106.72,32.22 U$17.12
DATA11
  Bottom 0.203: U$19.12 118.41,5.54 120.65,3.3 128.27,3.3 128.27,27.69 121.16,27.69 121.16,30.48 121.62,30.95 U$22.2
DATA12
  Bottom 0.203: U$24.2 133.18,4.28 132.21,3.3 130.81,3.3 130.81,31.11 129.71,32.22 U$22.12
DATA13
  Bottom 0.203: U$24.12 141.14,5.54 143.45,3.24 151.13,3.24 151.13,27.69 144.15,27.69 144.15,30.48 144.61,30.95 U$26.2
DATA14
  Bottom 0.203: U$28.2 156.42,4.28 155.45,3.3 153.67,3.3 153.67,31.11 152.57,32.22 U$26.12
DATA15
  Bottom 0.203: U$28.12 164.13,5.54 166.37,3.3 173.99,3.3 173.99,27.94 167,27.94 167,30.48 167.47,30.95 U$30.2
DATA16
  Bottom 0.203: U$32.2 179.15,4.28 178.18,3.3 176.53,3.3 176.53,31.11 175.43,32.22 U$30.12
DATA17
  Bottom 0.203: U$32.12 186.86,5.54 189.23,3.17 196.85,3.17 196.85,27.94 189.87,27.94 189.87,30.48 190.33,30.95 U$34.2
DATA18
  Bottom 0.203: U$36.2 202.14,4.28 201.04,3.17 199.39,3.17 199.39,31.11 198.29,32.22 U$34.12
DATA19
  Bottom 0.203: U$36.12 209.72,5.54 212.09,3.17 219.71,3.17 219.71,27.94 212.72,27.94 212.72,30.48 213.19,30.95 U$38.2
GND
  pour Bottom: 0,66.04 283.21,66.04 283.21,0 0,0
N$1
  Bottom 0.203: R1.2 16.51,38.61 16.51,39.37 16,39.88 13.97,39.88 12.7,41.15 U$2.R-
N$2
  Bottom 0.203: R2.2 18.8,40.89 U$2.G-
N$3
  Bottom 0.203: R3.2 20.95,41.27 U$2.B-
N$4
  Bottom 0.203: U$20.10 16.05,34.76 16.64,34.16 R1.1
N$5
  Bottom 0.203: U$20.9 16.93,36.02 R2.1
N$6
  Bottom 0.203: U$20.8 18.59,37.3 R3.1
N$7
  Bottom 0.203: U$20.6 7.79,36.02 7.11,36.7 7.11,38.1 8.38,39.37 R4.2
N$8
  Bottom 0.203: U$20.5 7.28,34.76 6.1,35.94 6.1,38.73 R5.2
N$9
  Bottom 0.203: U$20.4 7.03,33.48 4.57,35.94 R6.2
N$10
  Bottom 0.203: R49.2 108.08,39.24 107.44,39.88 105.03,39.88 104.14,40.77 U$16.R-
N$11
  Bottom 0.203: R7.2 28.07,12.57 27.34,13.3 24.71,13.3 24.13,13.88 U$1.R-
N$12
  Bottom 0.203: R8.2 30.23,14.22 U$1.G-
N$13
  Bottom 0.203: R9.2 32.38,14.61 U$1.B-
N$14
  Bottom 0.203: U$3.10 26.84,7.96 R7.1
N$15
  Bottom 0.203: U$3.9 28.49,9.23 R8.1
N$16
  Bottom 0.203: U$3.8 30.14,10.5 R9.1
N$17
  Bottom 0.203: U$3.6 18.84,9.23 R10.2
N$18
  Bottom 0.203: U$3.5 17.78,7.96 R11.2
N$19
  Bottom 0.203: U$3.4 18.75,6.69 R12.2
N$20
  Bottom 0.203: U$4.R- 35.56,41.15 36.83,39.88 38.86,39.88 39.5,39.24 R13.2
N$21
  Bottom 0.203: R14.2 41.66,40.89 U$4.G-
N$22
  Bottom 0.203: R15.2 43.81,41.27 U$4.B-
N$23
  Bottom 0.203: U$5.10 38.91,34.76 39.5,34.16 R13.1
N$24
  Bottom 0.203: U$5.9 39.79,36.02 R14.1
N$25
  Bottom 0.203: U$5.8 41.45,37.3 R15.1
N$26
  Bottom 0.203: U$5.6 30.52,36.02 29.97,36.58 29.97,38.1 31.24,39.37 R16.2
N$27
  Bottom 0.203: R17.2 29.21,38.99 29.21,35.81 30.27,34.76 U$5.5
N$28
  Bottom 0.203: U$5.4 29.38,33.48 27.43,35.43 R18.2
N$29
  Bottom 0.203: R19.2 50.93,12.7 50.33,13.3 47.69,13.3 46.99,14.01 U$6.R-
N$30
  Bottom 0.203: U$6.G- 53.09,14.22 R20.2
N$31
  Bottom 0.203: U$6.B- 55.24,14.61 R21.2
N$32
  Bottom 0.203: U$7.10 50.34,8.09 50.93,7.49 R19.1
N$33
  Bottom 0.203: U$7.9 52.11,9.36 53.09,8.38 R20.1
N$34
  Bottom 0.203: U$7.8 54.02,10.62 55.24,9.4 R21.1
N$35
  Bottom 0.203: U$7.6 41.57,9.36 R22.2
N$36
  Bottom 0.203: U$7.5 40.72,8.09 R23.2
N$37
  Bottom 0.203: U$7.4 41.74,6.82 R24.2
N$38
  Bottom 0.203: R25.2 62.36,39.12 61.59,39.88 59.44,39.88 58.42,40.89 U$8.R-
N$39
  Bottom 0.203: R26.2 64.52,40.89 U$8.G-
N$40
  Bottom 0.203: R27.2 66.67,41.27 U$8.B-
N$41
  Bottom 0.203: U$9.10 61,34.76 R25.1
N$42
  Bottom 0.203: U$9.9 62.65,36.02 R26.1
N$43
  Bottom 0.203: U$9.8 64.31,37.3 R27.1
N$44
  Bottom 0.203: R28.2 54.1,39.37 52.7,37.97 52.7,36.7 53.38,36.02 U$9.6
N$45
  Bottom 0.203: R29.2 51.69,38.61 51.69,36.07 53,34.76 U$9.5
N$46
  Bottom 0.203: R30.2 50.29,35.81 52.62,33.48 U$9.4
N$47
  Bottom 0.203: R31.2 73.79,12.7 73.15,13.34 70.61,13.34 69.85,14.1 U$10.R-
N$48
  Bottom 0.203: R32.2 75.95,14.22 U$10.G-
N$49
  Bottom 0.203: U$10.B- 78.11,14.61 R33.2
N$50
  Bottom 0.203: U$11.10 73.19,8.09 73.79,7.49 R31.1
N$51
  Bottom 0.203: U$11.9 74.85,9.36 75.95,8.26 R32.1
N$52
  Bottom 0.203: U$11.8 76.88,10.62 78.11,9.4 R33.1
N$53
  Bottom 0.203: R34.2 64.31,9.36 U$11.6
N$54
  Bottom 0.203: R35.2 65.74,8 U$11.5
N$55
  Bottom 0.203: R36.2 64.47,6.82 U$11.4
N$56
  Bottom 0.203: R37.2 85.22,39.24 84.58,39.88 82.17,39.88 81.28,40.77 U$12.R-
N$57
  Bottom 0.203: R38.2 87.38,40.89 U$12.G-
N$58
  Bottom 0.203: R39.2 89.53,41.27 U$12.B-
N$59
  Bottom 0.203: U$13.10 83.86,34.76 R37.1
N$60
  Bottom 0.203: U$13.9 85.51,36.02 R38.1
N$61
  Bottom 0.203: U$13.8 87.17,37.3 R39.1
N$62
  Bottom 0.203: R40.2 76.96,39.37 75.56,37.97 75.56,36.7 76.24,36.02 U$13.6
N$63
  Bottom 0.203: R41.2 74.55,38.61 74.55,36.2 75.99,34.76 U$13.5
N$64
  Bottom 0.203: R42.2 73.15,35.81 75.48,33.48 U$13.4
N$65
  Bottom 0.203: R43.2 96.65,12.7 96.14,13.21 93.47,13.21 92.71,13.97 U$14.R-
N$66
  Bottom 0.203: R44.2 98.81,14.22 U$14.G-
N$67
  Bottom 0.203: R45.2 100.97,14.61 U$14.B-
N$68
  Bottom 0.203: U$15.10 95.29,8.09 R43.1
N$69
  Bottom 0.203: U$15.9 96.94,9.36 R44.1
N$70
  Bottom 0.203: U$15.8 98.59,10.62 R45.1
N$71
  Bottom 0.203: U$15.6 87.17,9.36 R46.2
N$72
  Bottom 0.203: U$15.5 86.44,8.09 R47.2
N$73
  Bottom 0.203: U$15.4 87.33,6.82 R48.2
N$74
  Bottom 0.203: U$16.G- 110.24,40.89 R50.2
N$75
  Bottom 0.203: U$16.B- 112.39,41.27 R51.2
N$76
  Bottom 0.203: U$17.10 106.72,34.76 R49.1
N$77
  Bottom 0.203: U$17.9 108.37,36.02 R50.1
N$78
  Bottom 0.203: U$17.8 110.03,37.3 R51.1
N$79
  Bottom 0.203: R52.2 99.82,39.37 98.55,38.1 98.55,36.7 99.23,36.02 U$17.6
N$80
  Bottom 0.203: R53.2 97.41,38.61 97.41,36.07 98.72,34.76 U$17.5
N$81
  Bottom 0.203: R54.2 96.01,35.56 98.09,33.48 U$17.4
N$82
  Bottom 0.203: R97.2 199.52,39.24 198.88,39.88 196.6,39.88 195.58,40.89 U$33.R-
N$83
  Bottom 0.203: R55.2 119.51,12.57 118.87,13.21 116.33,13.21 115.57,13.97 U$18.R-
N$84
  Bottom 0.203: R56.2 121.67,14.22 U$18.G-
N$85
  Bottom 0.203: R57.2 123.83,14.61 U$18.B-
N$86
  Bottom 0.203: U$19.10 118.15,8.09 R55.1
N$87
  Bottom 0.203: U$19.9 119.8,9.36 R56.1
N$88
  Bottom 0.203: U$19.8 121.45,10.62 R57.1
N$89
  Bottom 0.203: U$19.6 110.03,9.36 R58.2
N$90
  Bottom 0.203: U$19.5 109.3,8.09 R59.2
N$91
  Bottom 0.203: U$19.4 110.19,6.82 R60.2
N$92
  Bottom 0.203: R61.2 130.94,39.24 130.3,39.88 127.89,39.88 127,40.77 U$21.R-
N$93
  Bottom 0.203: R62.2 133.1,40.89 U$21.G-
N$94
  Bottom 0.203: R63.2 135.25,41.27 U$21.B-
N$95
  Bottom 0.203: U$22.10 129.58,34.76 R61.1
N$96
  Bottom 0.203: U$22.9 131.23,36.02 R62.1
N$97
  Bottom 0.203: U$22.8 132.88,37.3 R63.1
N$98
  Bottom 0.203: R64.2 122.68,39.37 121.28,37.97 121.28,36.7 121.96,36.02 U$22.6
N$99
  Bottom 0.203: R65.2 120.27,38.61 120.27,36.32 121.84,34.76 U$22.5
N$100
  Bottom 0.203: R66.2 118.87,35.94 121.33,33.48 U$22.4
N$101
  Bottom 0.203: R67.2 142.37,12.57 141.73,13.21 139.32,13.21 138.43,14.1 U$23.R-
N$102
  Bottom 0.203: R68.2 144.53,14.22 U$23.G-
N$103
  Bottom 0.203: R69.2 146.69,14.61 U$23.B-
N$104
  Bottom 0.203: U$24.10 141.01,8.09 R67.1
N$105
  Bottom 0.203: U$24.9 142.66,9.36 R68.1
N$106
  Bottom 0.203: U$24.8 144.31,10.62 R69.1
N$107
  Bottom 0.203: U$24.6 132.88,9.36 R70.2
N$108
  Bottom 0.203: U$24.5 132.16,8.09 R71.2
N$109
  Bottom 0.203: U$24.4 133.05,6.82 R72.2
N$110
  Bottom 0.203: R73.2 153.8,39.12 153.03,39.88 150.75,39.88 149.86,40.77 U$25.R-
N$111
  Bottom 0.203: R74.2 155.96,40.89 U$25.G-
N$112
  Bottom 0.203: R75.2 158.12,41.27 U$25.B-
N$113
  Bottom 0.203: U$26.10 152.44,34.76 R73.1
N$114
  Bottom 0.203: U$26.9 154.09,36.02 R74.1
N$115
  Bottom 0.203: U$26.8 155.75,37.3 R75.1
N$116
  Bottom 0.203: R76.2 145.54,39.37 144.15,37.97 144.15,36.45 144.57,36.02 U$26.6
N$117
  Bottom 0.203: R77.2 143.38,38.86 143.38,35.94 144.57,34.76 U$26.5
N$118
  Bottom 0.203: R78.2 141.73,35.94 144.19,33.48 U$26.4
N$119
  Bottom 0.203: R79.2 165.23,12.57 164.59,13.21 162.18,13.21 161.29,14.1 U$27.R-
N$120
  Bottom 0.203: R80.2 167.39,14.22 U$27.G-
N$121
  Bottom 0.203: R81.2 169.54,14.61 U$27.B-
N$122
  Bottom 0.203: U$28.10 163.87,8.09 R79.1
N$123
  Bottom 0.203: U$28.9 165.52,9.36 R80.1
N$124
  Bottom 0.203: U$28.8 167.18,10.62 R81.1
N$125
  Bottom 0.203: U$28.6 155.75,9.36 R82.2
N$126
  Bottom 0.203: U$28.5 155.02,8.09 R83.2
N$127
  Bottom 0.203: U$28.4 155.91,6.82 R84.2
N$128
  Bottom 0.203: R85.2 176.66,39.24 175.9,40.01 173.74,40.01 172.72,41.02 U$29.R-
N$129
  Bottom 0.203: R86.2 178.82,40.89 U$29.G-
N$130
  Bottom 0.203: R87.2 180.97,41.27 U$29.B-
N$131
  Bottom 0.203: U$30.10 175.3,34.76 R85.1
N$132
  Bottom 0.203: U$30.9 176.95,36.02 R86.1
N$133
  Bottom 0.203: U$30.8 178.6,37.3 R87.1
N$134
  Bottom 0.203: R88.2 168.4,39.37 167.13,38.1 167.13,36.58 167.68,36.02 U$30.6
N$135
  Bottom 0.203: U$30.5 167.18,34.76 166.37,35.56 166.37,38.99 R89.2
N$136
  Bottom 0.203: R90.2 164.59,35.43 166.54,33.48 U$30.4
N$137
  Bottom 0.203: R91.2 188.09,12.57 187.45,13.21 185.17,13.21 184.15,14.22 U$31.R-
N$138
  Bottom 0.203: R92.2 190.25,14.22 U$31.G-
N$139
  Bottom 0.203: R93.2 192.41,14.61 U$31.B-
N$140
  Bottom 0.203: U$32.10 186.73,8.09 R91.1
N$141
  Bottom 0.203: U$32.9 188.38,9.36 R92.1
N$142
  Bottom 0.203: U$32.8 190.03,10.62 R93.1
N$143
  Bottom 0.203: U$32.6 178.6,9.36 R94.2
N$144
  Bottom 0.203: U$32.5 177.88,8.09 R95.2
N$145
  Bottom 0.203: U$32.4 178.77,6.82 R96.2
N$146
  Bottom 0.203: R98.2 201.68,40.89 U$33.G-
N$147
  Bottom 0.203: R99.2 203.84,41.27 U$33.B-
N$148
  Bottom 0.203: U$34.10 198.16,34.76 R97.1
N$149
  Bottom 0.203: U$34.9 199.81,36.02 R98.1
N$150
  Bottom 0.203: U$34.8 201.47,37.3 R99.1
N$151
  Bottom 0.203: U$34.6 190.42,36.02 189.74,36.7 189.74,37.85 191.26,39.37 R100.2
N$152
  Bottom 0.203: R101.2 188.85,38.61 188.85,36.2 190.29,34.76 U$34.5
N$153
  Bottom 0.203: R102.2 187.45,35.94 189.91,33.48 U$34.4
N$154
  Bottom 0.203: R103.2 210.95,12.57 210.31,13.21 207.9,13.21 207.01,14.1 U$35.R-
N$155
  Bottom 0.203: U$35.G- 213.11,14.22 R104.2
N$156
  Bottom 0.203: U$35.B- 215.26,14.61 R105.2
N$157
  Bottom 0.203: U$36.10 209.59,8.09 R103.1
N$158
  Bottom 0.203: U$36.9 211.24,9.36 R104.1
N$159
  Bottom 0.203: U$36.8 212.9,10.62 R105.1
N$160
  Bottom 0.203: U$36.6 201.47,9.36 R106.2
N$161
  Bottom 0.203: U$36.5 200.74,8.09 R107.2
N$162
  Bottom 0.203: U$36.4 201.63,6.82 R108.2
N$163
  Bottom 0.203: R109.2 222.38,39.24 221.74,39.88 219.46,39.88 218.44,40.89 U$37.R-
N$164
  Bottom 0.203: U$37.G- 224.54,40.89 R110.2
N$165
  Bottom 0.203: U$37.B- 226.69,41.27 R111.2
N$166
  Bottom 0.203: U$38.10 221.02,34.76 R109.1
N$167
  Bottom 0.203: U$38.9 222.67,36.02 R110.1
N$168
  Bottom 0.203: U$38.8 224.32,37.3 R111.1
N$169
  Bottom 0.203: U$38.6 213.53,36.02 212.72,36.83 212.72,37.97 214.12,39.37 R112.2
N$170
  Bottom 0.203: R113.2 211.58,38.48 211.58,36.32 213.15,34.76 U$38.5
N$171
  Bottom 0.203: R114.2 210.31,36.07 212.9,33.48 U$38.4
ROW1
  Top 0.203: U$2.MX1 12.7,54.61 35.56,54.61 | 35.56,54.61 U$4.MX1 | 35.56,54.61 58.42,54.61 | 58.42,54.61 U$8.MX1 | 58.42,54.61 81.28,54.61 | 81.28,54.61 U$12.MX1 | 81.28,54.61 104.14,54.61 | 104.14,54.61 127,54.61 | 127,54.61 149.86,54.61 | 149.86,54.61 172.72,54.61 | 172.72,54.61 195.58,54.61 | 195.58,54.61 218.44,54.61 | U$37.MX1 218.44,54.61 | U$33.MX1 195.58,54.61 | U$29.MX1 172.72,54.61 | U$25.MX1 149.86,54.61 | U$16.MX1 104.14,54.61 | U$21.MX1 127,54.61 | 218.44,54.61 224.79,54.61 228.6,50.8 228.6,40.64 229.62,39.62 IC1.26
ROW2
  Top 0.203: U$1.MX1 26.07,22.86 26.65,23.44 29.23,23.44 29.81,22.86 U$6.MX1 48.93,22.86 49.51,23.44 52.09,23.44 52.67,22.86 U$10.MX1 71.79,22.86 72.37,23.44 74.95,23.44 75.53,22.86 U$14.MX1 94.65,22.86 95.23,23.44 97.81,23.44 98.39,22.86 U$18.MX1 117.51,22.86 118.09,23.44 120.67,23.44 121.25,22.86 U$23.MX1 140.37,22.86 140.95,23.44 143.53,23.44 144.11,22.86 U$27.MX1 163.23,22.86 163.81,23.44 166.39,23.44 166.97,22.86 U$31.MX1 186.09,22.86 186.67,23.44 189.25,23.44 189.83,22.86 U$35.MX1 208.95,22.86 209.53,23.44 212.11,23.44 212.69,22.86 IC1.20
VCC
  Bottom 0.203: U$6.LED+ 49.53,16.13 48.64,17.02 46.23,17.02 45.21,16 45.21,4.06 46.27,3 U$7.14 48.64,1.78 | U$1.LED+ 26.67,16.14 25.89,16.93 23.26,16.93 22.32,15.98 22.32,3.85 23.29,2.88 U$3.14 25.78,1.78 | U$10.LED+ 72.39,16.13 71.5,17.02 69.22,17.02 68.2,16 68.2,4.06 69.26,3 U$11.14 71.5,1.78 | U$20.14 12.23,29.68 10.92,30.99 10.92,42.93 11.68,43.69 14.48,43.69 15.24,42.93 U$2.LED+ | U$20.14 15.24,29.68 15.24,1.78 25.78,1.78 | U$4.LED+ 38.1,42.8 37.21,43.69 34.67,43.69 33.66,42.67 33.66,30.73 34.71,29.68 U$5.14 38.1,29.68 38.1,1.78 | 48.64,1.78 38.1,1.78 | 25.78,1.78 38.1,1.78 | 48.64,1.78 60.96,1.78 | 60.96,1.78 71.5,1.78 | 71.5,1.78 83.82,1.78 | 83.82,1.78 94.36,1.78 | 94.36,1.78 106.68,1.78 | 106.68,1.78 117.22,1.78 | 117.22,1.78 129.54,1.78 | 129.54,1.78 140.08,1.78 | 140.08,1.78 152.4,1.78 | 152.4,1.78 162.94,1.78 | 162.94,1.78 175.26,1.78 | 175.26,1.78 185.8,1.78 | 94.36,1.78 U$15.14 92.25,3 91.19,4.06 91.19,16 92.2,17.02 94.36,17.02 95.25,16.13 U$14.LED+ | 117.22,1.78 U$19.14 115.23,3 114.05,4.19 114.05,16.13 114.94,17.02 117.35,17.02 118.11,16.26 U$18.LED+ | 140.08,1.78 U$24.14 137.71,3 136.78,3.94 136.78,16.26 137.54,17.02 140.21,17.02 140.97,16.26 U$23.LED+ | 162.94,1.78 U$28.14 160.82,3 159.64,4.19 159.64,16 160.66,17.02 162.81,17.02 163.83,16 U$27.LED+ | 185.8,1.78 U$32.14 183.69,3 182.5,4.19 182.5,16.13 183.26,16.89 185.93,16.89 186.69,16.13 U$31.LED+ | 208.66,1.78 U$36.14 206.8,3 205.49,4.32 205.49,16.13 206.25,16.89 208.79,16.89 209.55,16.13 U$35.LED+ | 185.8,1.78 198.12,1.78 | 198.12,1.78 208.66,1.78 | 60.96,1.78 60.96,29.21 60.49,29.68 U$9.14 57.95,29.68 56.77,30.86 56.77,42.93 57.53,43.69 60.07,43.69 60.96,42.8 U$8.LED+
  Bottom 0.203: 83.82,1.78 83.82,29.21 83.36,29.68 U$13.14 81.07,29.68 79.76,30.99 79.76,42.8 80.52,43.56 83.19,43.56 83.82,42.93 U$12.LED+ | 106.68,1.78 106.68,29.21 106.22,29.68 U$17.14 103.8,29.68 102.49,30.99 102.49,42.93 103.25,43.69 105.92,43.69 106.68,42.93 U$16.LED+ | 129.54,1.78 129.54,29.21 129.07,29.68 U$22.14 126.66,29.68 125.35,30.99 125.35,42.8 126.24,43.69 128.65,43.69 129.54,42.8 U$21.LED+ | 152.4,1.78 152.4,29.21 151.94,29.68 U$26.14 149.4,29.68 148.21,30.86 148.21,42.8 148.97,43.56 151.64,43.56 152.4,42.8 U$25.LED+ | 175.26,1.78 175.26,29.21 174.79,29.68 U$30.14 172.25,29.68 171.07,30.86 171.07,42.67 172.09,43.69 174.24,43.69 175.26,42.67 U$29.LED+ | 198.12,1.78 198.12,29.21 197.66,29.68 U$34.14 195.24,29.68 193.93,30.99 193.93,42.67 194.94,43.69 197.1,43.69 198.12,42.67 U$33.LED+ | 208.66,1.78 220.98,1.78 220.98,29.21 220.51,29.68 U$38.14 217.97,29.68 216.66,30.99 216.66,42.42 217.93,43.69 219.71,43.69 220.98,42.42 U$37.LED+ | IC1.3 247.65,30.48 243.84,34.29 243.84,61.09 240.16,64.77 10.16,64.77 1.27,55.88 1.27,31.75 5.08,27.94 12.61,27.94 U$20.14